# EAGLE design BBB_Cape_schematics (EAGLE 6.2)

## Sheet 1 of 3: BB_Cape pinouts
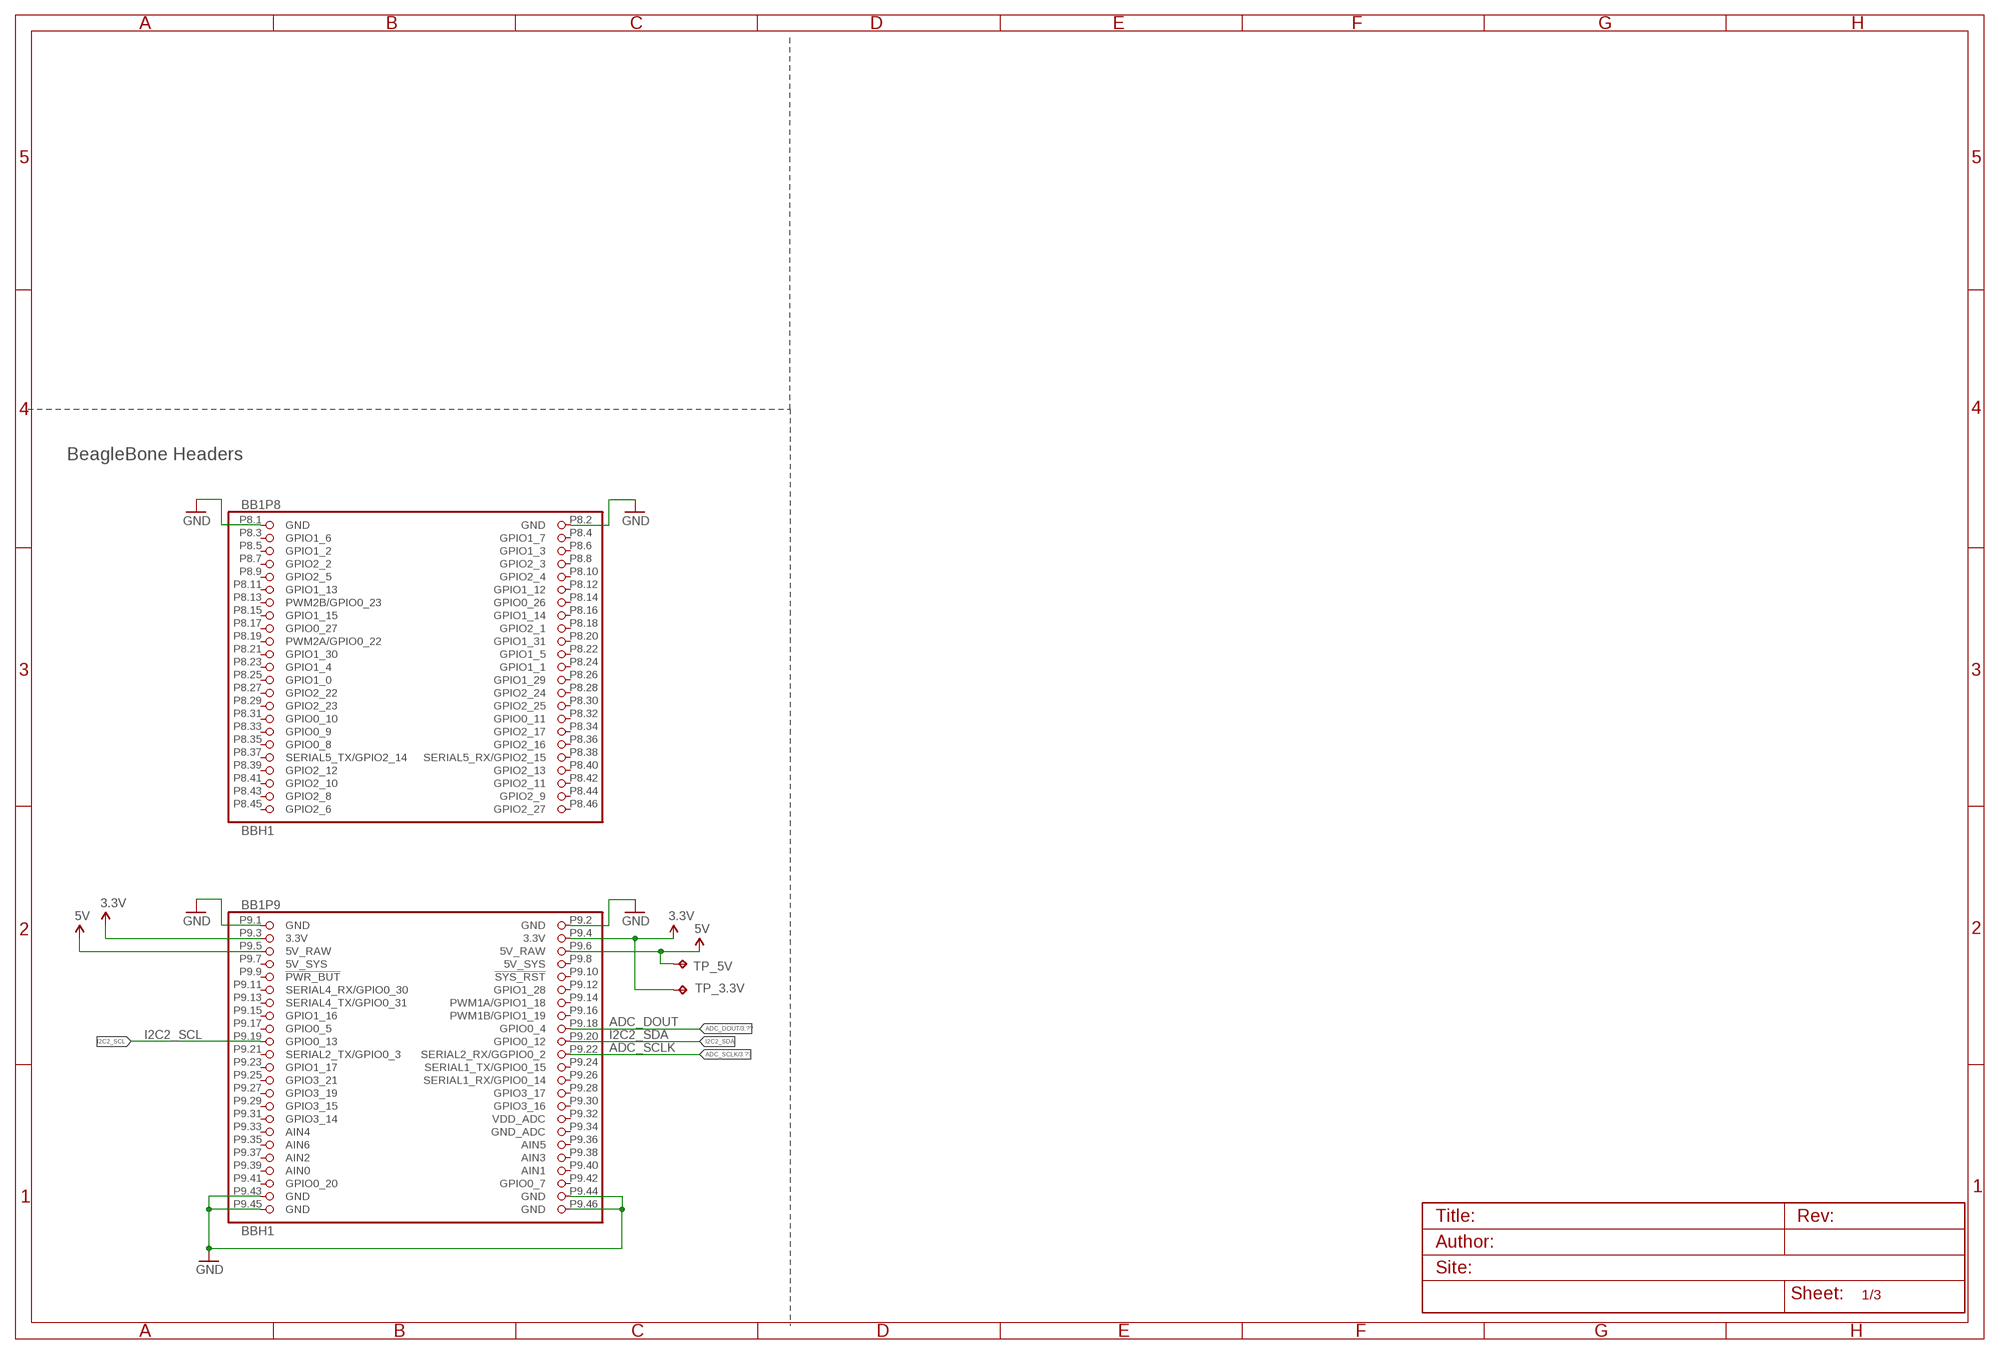
[diagram p0: schematic, sheet 1]

### Parts
BB1  BBH1  [BB_CAPE]
TP_3.3V  TPB2,54  [B2,54]
TP_5V  TPB2,54  [B2,54]

### Nets
3.3V: BB1.P9.3(P9:3.3V) BB1.P9.4(P9:3.3V) TP_3.3V.TP ; also sheet 3
5V: BB1.P9.5(P9:5V_RAW) BB1.P9.6(P9:5V_RAW) TP_5V.TP ; also sheet 2,3
ADC_DOUT: BB1.P9.18(P9:GPIO0_4) ; also sheet 3
ADC_SCLK: BB1.P9.22(P9:SERIAL2_RX/GGPIO0_2) ; also sheet 3
GND: BB1.P8.1(P8:GND) BB1.P8.2(P8:GND) BB1.P9.1(P9:GND) BB1.P9.2(P9:GND) BB1.P9.43(P9:GND) BB1.P9.44(P9:GND) BB1.P9.45(P9:GND) BB1.P9.46(P9:GND) ; also sheet 2,3
I2C2_SCL: BB1.P9.19(P9:GPIO0_13)
I2C2_SDA: BB1.P9.20(P9:GPIO0_12)
Unconnected: BB1.P8.3(P8:GPIO1_6) BB1.P8.4(P8:GPIO1_7) BB1.P8.5(P8:GPIO1_2) BB1.P8.6(P8:GPIO1_3) BB1.P8.7(P8:GPIO2_2) BB1.P8.8(P8:GPIO2_3) BB1.P8.9(P8:GPIO2_5) BB1.P8.10(P8:GPIO2_4) BB1.P8.11(P8:GPIO1_13) BB1.P8.12(P8:GPIO1_12) BB1.P8.13(P8:PWM2B/GPIO0_23) BB1.P8.14(P8:GPIO0_26) BB1.P8.15(P8:GPIO1_15) BB1.P8.16(P8:GPIO1_14) BB1.P8.17(P8:GPIO0_27) BB1.P8.18(P8:GPIO2_1) BB1.P8.19(P8:PWM2A/GPIO0_22) BB1.P8.20(P8:GPIO1_31) BB1.P8.21(P8:GPIO1_30) BB1.P8.22(P8:GPIO1_5) BB1.P8.23(P8:GPIO1_4) BB1.P8.24(P8:GPIO1_1) BB1.P8.25(P8:GPIO1_0) BB1.P8.26(P8:GPIO1_29) BB1.P8.27(P8:GPIO2_22) BB1.P8.28(P8:GPIO2_24) BB1.P8.29(P8:GPIO2_23) BB1.P8.30(P8:GPIO2_25) BB1.P8.31(P8:GPIO0_10) BB1.P8.32(P8:GPIO0_11) BB1.P8.33(P8:GPIO0_9) BB1.P8.34(P8:GPIO2_17) BB1.P8.35(P8:GPIO0_8) BB1.P8.36(P8:GPIO2_16) BB1.P8.37(P8:SERIAL5_TX/GPIO2_14) BB1.P8.38(P8:SERIAL5_RX/GPIO2_15) BB1.P8.39(P8:GPIO2_12) BB1.P8.40(P8:GPIO2_13) BB1.P8.41(P8:GPIO2_10) BB1.P8.42(P8:GPIO2_11) BB1.P8.43(P8:GPIO2_8) BB1.P8.44(P8:GPIO2_9) BB1.P8.45(P8:GPIO2_6) BB1.P8.46(P8:GPIO2_27) BB1.P9.9(P9:!PWR_BUT) BB1.P9.10(P9:!SYS_RST) BB1.P9.11(P9:SERIAL4_RX/GPIO0_30) BB1.P9.12(P9:GPIO1_28) BB1.P9.13(P9:SERIAL4_TX/GPIO0_31) BB1.P9.14(P9:PWM1A/GPIO1_18) BB1.P9.15(P9:GPIO1_16) BB1.P9.16(P9:PWM1B/GPIO1_19) BB1.P9.17(P9:GPIO0_5) BB1.P9.21(P9:SERIAL2_TX/GPIO0_3) BB1.P9.23(P9:GPIO1_17) BB1.P9.24(P9:SERIAL1_TX/GPIO0_15) BB1.P9.25(P9:GPIO3_21) BB1.P9.26(P9:SERIAL1_RX/GPIO0_14) BB1.P9.27(P9:GPIO3_19) BB1.P9.28(P9:GPIO3_17) BB1.P9.29(P9:GPIO3_15) BB1.P9.30(P9:GPIO3_16) BB1.P9.31(P9:GPIO3_14) BB1.P9.32(P9:VDD_ADC) BB1.P9.33(P9:AIN4) BB1.P9.34(P9:GND_ADC) BB1.P9.35(P9:AIN6) BB1.P9.36(P9:AIN5) BB1.P9.37(P9:AIN2) BB1.P9.38(P9:AIN3) BB1.P9.39(P9:AIN0) BB1.P9.40(P9:AIN1) BB1.P9.41(P9:GPIO0_20) BB1.P9.42(P9:GPIO0_7)

### Notes on the sheet
- BeagleBone Headers
- ADC_DOUT
- ADC_SCLK

## Sheet 2 of 3: ECG_circuit
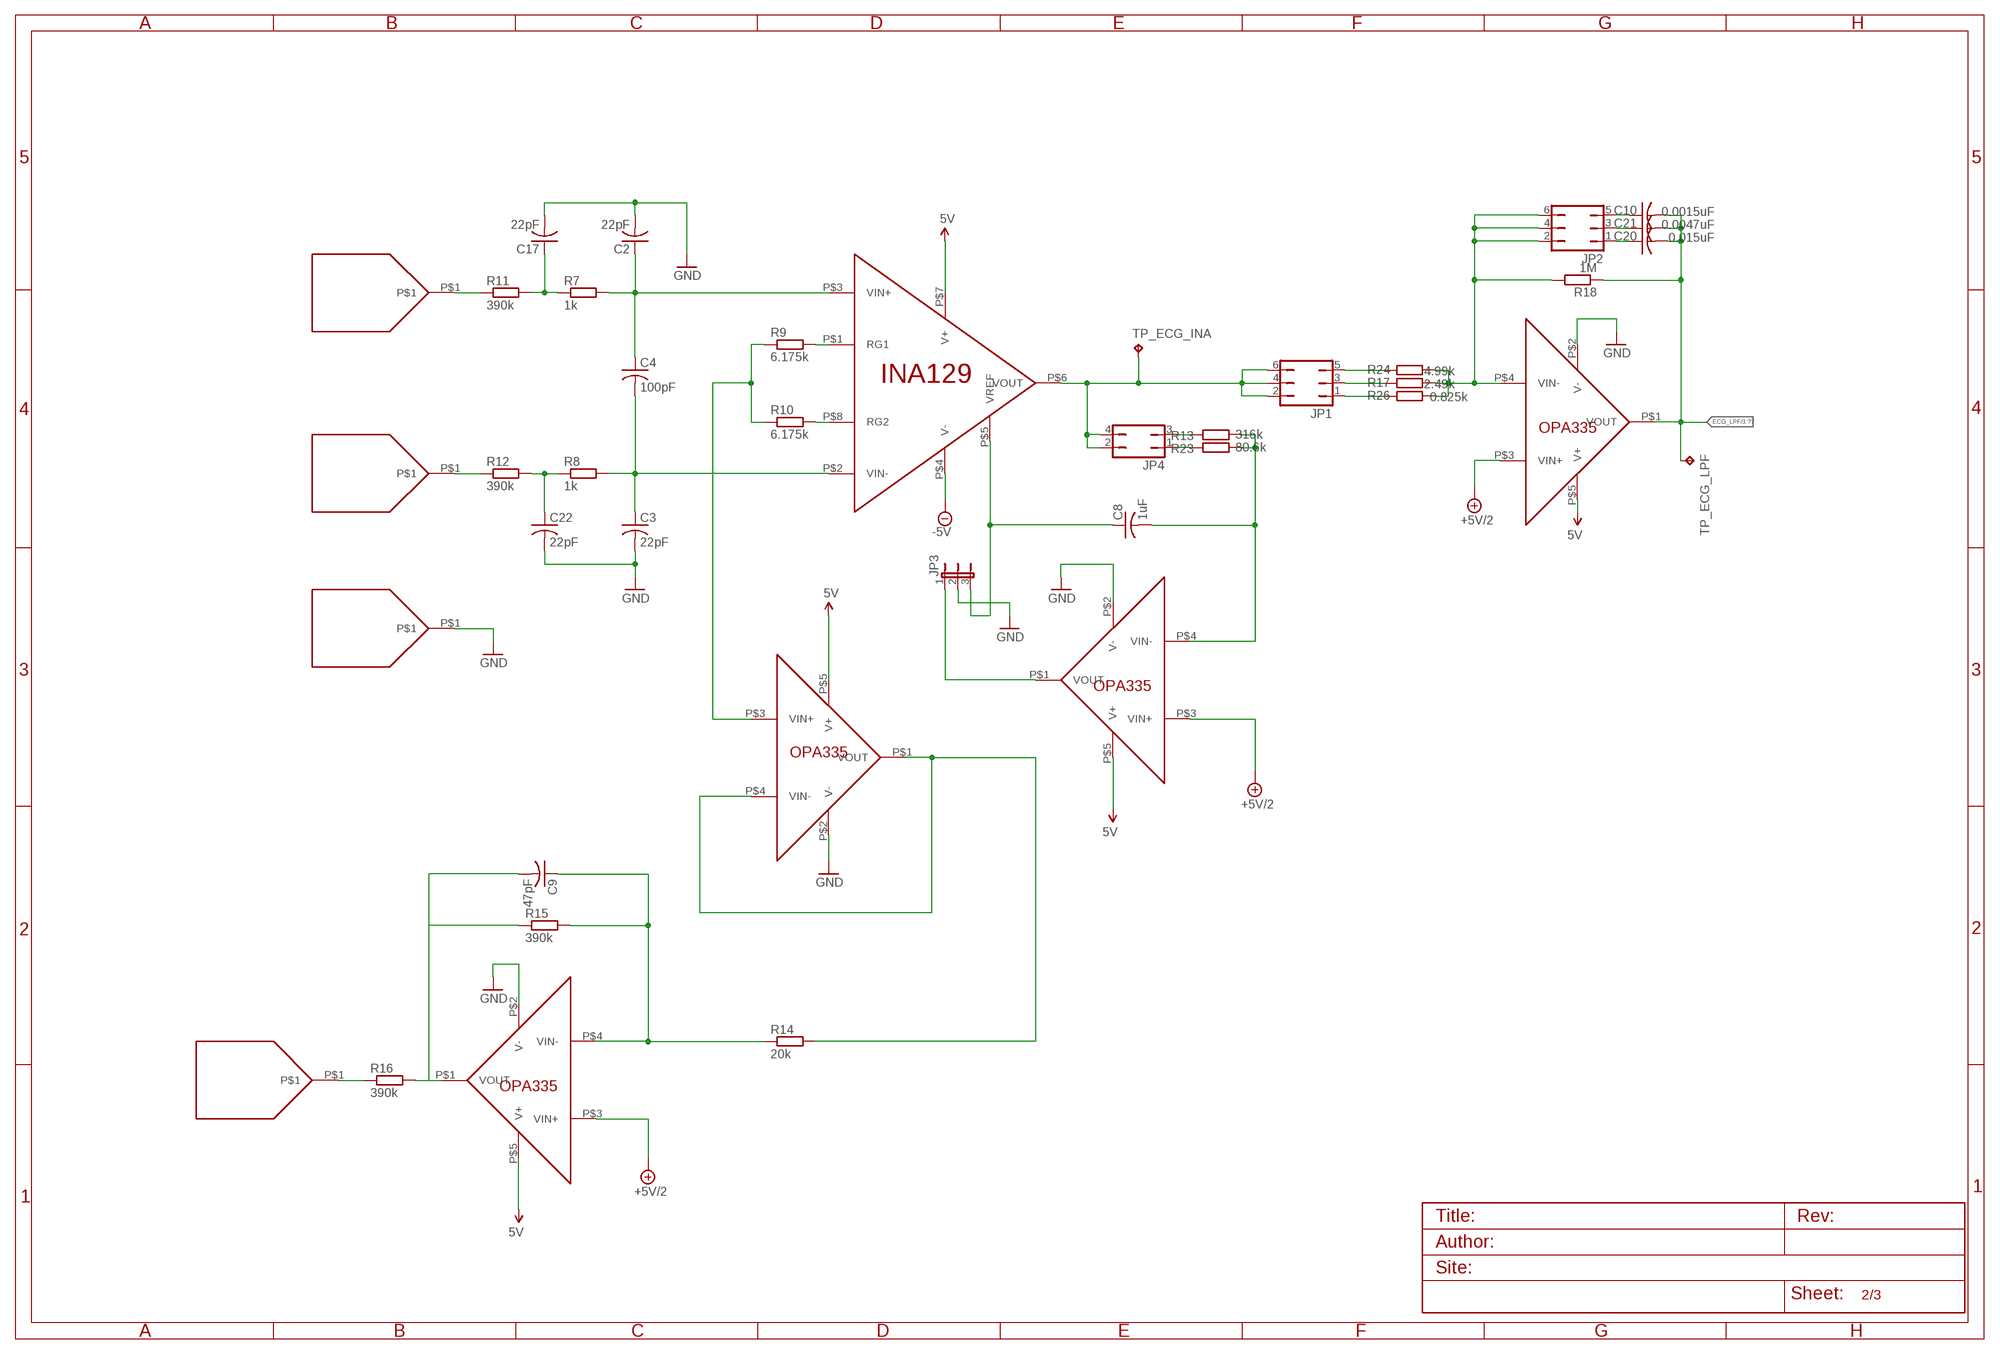
[diagram p1: schematic, sheet 2]

### Parts
C2  22pF  C-USC1206  [C1206]
C3  22pF  C-USC1206  [C1206]
C4  100pF  C-USC1206  [C1206]
C8  1uF  C-USC1206  [C1206]
C9  47pF  C-USC1206  [C1206]
C10  0.0015uF  C-USC1206  [C1206]
C17  22pF  C-USC1206  [C1206]
C20  0.015uF  C-USC1206  [C1206]
C21  0.0047uF  C-USC1206  [C1206]
C22  22pF  C-USC1206  [C1206]
JP1  JP3Q  [JP3Q]
JP2  JP3Q  [JP3Q]
JP3  JP2E  [JP2]
JP4  JP2Q  [JP2Q]
LH  PAD  [RECT_PAD]
LH_INDEX  PAD  [RECT_PAD]
R7  1k  R-EU_M1206  [M1206]
R8  1k  R-EU_M1206  [M1206]
R9  6.175k  R-EU_M1206  [M1206]
R10  6.175k  R-EU_M1206  [M1206]
R11  390k  R-EU_M1206  [M1206]
R12  390k  R-EU_M1206  [M1206]
R13  316k  R-EU_M1206  [M1206]
R14  20k  R-EU_M1206  [M1206]
R15  390k  R-EU_M1206  [M1206]
R16  390k  R-EU_M1206  [M1206]
R17  2.49k  R-EU_M1206  [M1206]
R18  1M  R-EU_M1206  [M1206]
R23  80.6k  R-EU_M1206  [M1206]
R24  4.99k  R-EU_M1206  [M1206]
R26  0.825k  R-EU_M1206  [M1206]
RH  PAD  [RECT_PAD]
RH_INDEX  PAD  [RECT_PAD]
TP_ECG_INA  TPB2,54  [B2,54]
TP_ECG_LPF  TPB2,54  [B2,54]
U4  INA129  [INA129]
U9  OPA335  [SOT23-5]
U11  OPA335  [SOT23-5]
U12  OPA335  [SOT23-5]
U13  OPA335  [SOT23-5]

### Nets
5V: U4.P$7(V+) U9.P$5(V+) U11.P$5(V+) U12.P$5(V+) U13.P$5(V+) ; also sheet 1,3
+5V/2: U9.P$3(VIN+) U12.P$3(VIN+) U13.P$3(VIN+) ; also sheet 3
-5V: U4.P$4(V-) ; also sheet 3
ECG_LPF: C10.2 C20.2 C21.2 R18.1 TP_ECG_LPF.TP U13.P$1(VOUT) ; also sheet 3
GND: C2.2 C3.2 C17.2 C22.2 JP3.2 RH_INDEX.P$1 U9.P$2(V-) U11.P$2(V-) U12.P$2(V-) U13.P$2(V-) ; also sheet 1,3
N$1: C2.1 C4.1 R7.2 U4.P$3(VIN+)
N$2: C3.1 C4.2 R8.2 U4.P$2(VIN-)
N$3: R9.2 U4.P$1(RG1)
N$4: R10.2 U4.P$8(RG2)
N$5: R9.1 R10.1 U11.P$3(VIN+)
N$7: C17.1 R7.1 R11.2
N$8: C22.1 R8.1 R12.2
N$10: C8.1 JP3.3 U4.P$5(VREF)
N$11: JP1.2 JP1.4 JP1.6 JP4.2 JP4.4 TP_ECG_INA.TP U4.P$6(VOUT)
N$12: C8.2 R13.2 R23.2 U9.P$4(VIN-)
N$16: R14.2 U11.P$1(VOUT) U11.P$4(VIN-)
N$17: C9.1 R14.1 R15.2 U12.P$4(VIN-)
N$18: JP2.2 JP2.4 JP2.6 R17.1 R18.2 R24.1 R26.1 U13.P$4(VIN-)
N$19: C9.2 R15.1 R16.2 U12.P$1(VOUT)
N$22: LH_INDEX.P$1 R16.1
N$23: R11.1 RH.P$1
N$24: LH.P$1 R12.1
N$33: JP4.3 R13.1
N$34: JP4.1 R23.1
N$35: JP3.1 U9.P$1(VOUT)
N$36: JP1.5 R24.2
N$37: JP1.3 R17.2
N$38: JP1.1 R26.2
N$40: C10.1 JP2.5
N$41: C21.1 JP2.3
N$42: C20.1 JP2.1

## Sheet 3 of 3: Power Supply
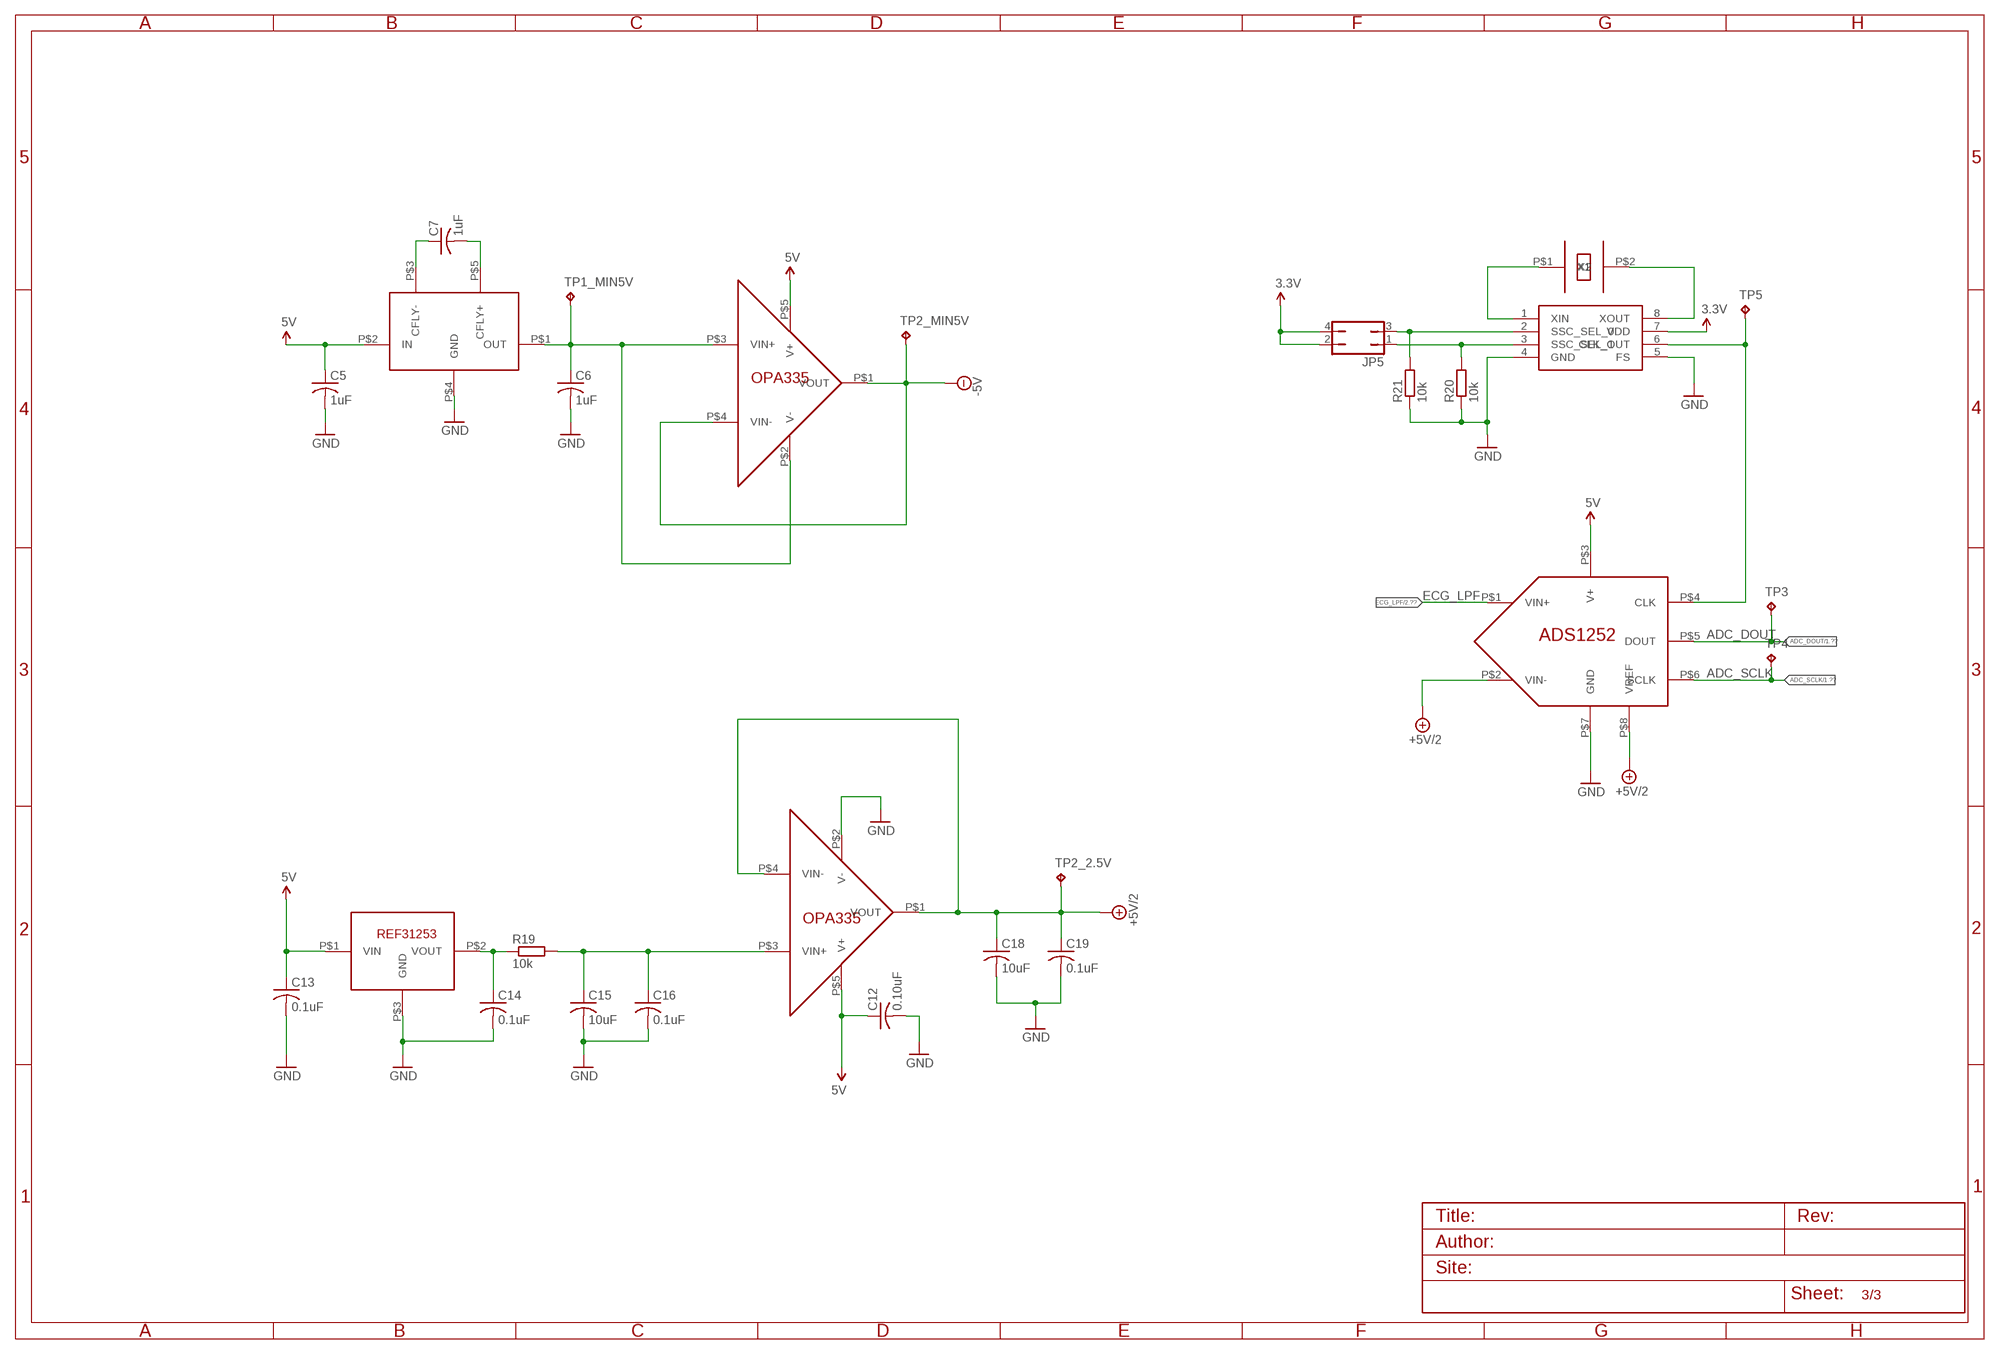
[diagram p2: schematic, sheet 3]

### Parts
C5  1uF  C-USC1206  [C1206]
C6  1uF  C-USC1206  [C1206]
C7  1uF  C-USC1206  [C1206]
C12  0.10uF  C-USC1206  [C1206]
C13  0.1uF  C-USC1206  [C1206]
C14  0.1uF  C-USC1206  [C1206]
C15  10uF  C-USC1206  [C1206]
C16  0.1uF  C-USC1206  [C1206]
C18  10uF  C-USC1206  [C1206]
C19  0.1uF  C-USC1206  [C1206]
JP5  JP2Q  [JP2Q]
R19  10k  R-EU_M1206  [M1206]
R20  10k  R-EU_M1206  [M1206]
R21  10k  R-EU_M1206  [M1206]
TP1_MIN5V  TPB2,54  [B2,54]
TP2_2.5V  TPB2,54  [B2,54]
TP2_MIN5V  TPB2,54  [B2,54]
TP3  TPB2,54  [B2,54]
TP4  TPB2,54  [B2,54]
TP5  TPB2,54  [B2,54]
U5  TPS60403  [SOT23-5]
U10  CDCS502  [SSOP-8]
U14  OPA335  [SOT23-5]
U19  ADS1252  [SOIC-8]
U21  REF3125  [SOT23-3]
U22  OPA335  [SOT23-5]
U23  ATS16ASM-1  [CRYSTAL_SMD]

### Nets
3.3V: JP5.2 JP5.4 U10.7(VDD) ; also sheet 1
5V: C5.1 C12.1 C13.1 U5.P$2(IN) U14.P$5(V+) U19.P$3(V+) U21.P$1(VIN) U22.P$5(V+) ; also sheet 1,2
+5V/2: C18.1 C19.1 TP2_2.5V.TP U19.P$2(VIN-) U19.P$8(VREF) U22.P$1(VOUT) U22.P$4(VIN-) ; also sheet 2
-5V: TP2_MIN5V.TP U14.P$1(VOUT) U14.P$4(VIN-) ; also sheet 2
ADC_DOUT: TP3.TP U19.P$5(DOUT) ; also sheet 1
ADC_SCLK: TP4.TP U19.P$6(SCLK) ; also sheet 1
ECG_LPF: U19.P$1(VIN+) ; also sheet 2
GND: C5.2 C6.2 C12.2 C13.2 C14.2 C15.2 C16.2 C18.2 C19.2 R20.1 R21.1 U5.P$4(GND) U10.4(GND) U10.5(FS) U19.P$7(GND) U21.P$3(GND) U22.P$2(V-) ; also sheet 1,2
N$6: C7.2 U5.P$5(CFLY+)
N$9: C7.1 U5.P$3(CFLY-)
N$21: C6.1 TP1_MIN5V.TP U5.P$1(OUT) U14.P$2(V-) U14.P$3(VIN+)
N$25: C14.1 R19.1 U21.P$2(VOUT)
N$26: C15.1 C16.1 R19.2 U22.P$3(VIN+)
N$27: U10.1(XIN) U23.P$1(X1)
N$28: U10.8(XOUT) U23.P$2(X2)
N$29: TP5.TP U10.6(CLK_OUT) U19.P$4(CLK)
N$30: JP5.3 R21.2 U10.2(SSC_SEL_0)
N$31: JP5.1 R20.2 U10.3(SSC_SEL_1)

### Notes on the sheet
- ECG_LPF
- ADC_DOUT
- ADC_SCLK
- REF31253

## Power pins joined to a net without a drawn wire
5V_SYS: BB1.P9.7(P9:5V_SYS) BB1.P9.8(P9:5V_SYS)

## Library data of the parts
BB1 = logic-supply:BBH: BeagleBone header sub-assembly BBH1 outdated, use BBH2 or BBH3 only; PARTNO: BBH1
C2-C10 C12-C22 = rcl:C-US: CAPACITOR, American symbol
JP1 JP2 = jumper:JP3Q: JUMPER
JP3 = jumper:JP2E: JUMPER
JP4 JP5 = jumper:JP2Q: JUMPER
LH LH_INDEX RH RH_INDEX = Components:PAD
R7-R21 R23 R24 R26 = resistor:R-EU_: RESISTOR, European symbol
TP1_MIN5V TP2_2.5V TP2_MIN5V TP3-TP5 TP_3.3V TP_5V TP_ECG_INA TP_ECG_LPF = testpad:TP: Test pad
U4 = Components:INA129
U5 = Components:TPS60403
U9 U11-U14 U22 = Components:OPA335
U10 = Components:CDCS502
U19 = Components:ADS1252
U21 = Components:REF3125
U23 = Components:ATS16ASM-1

## Board
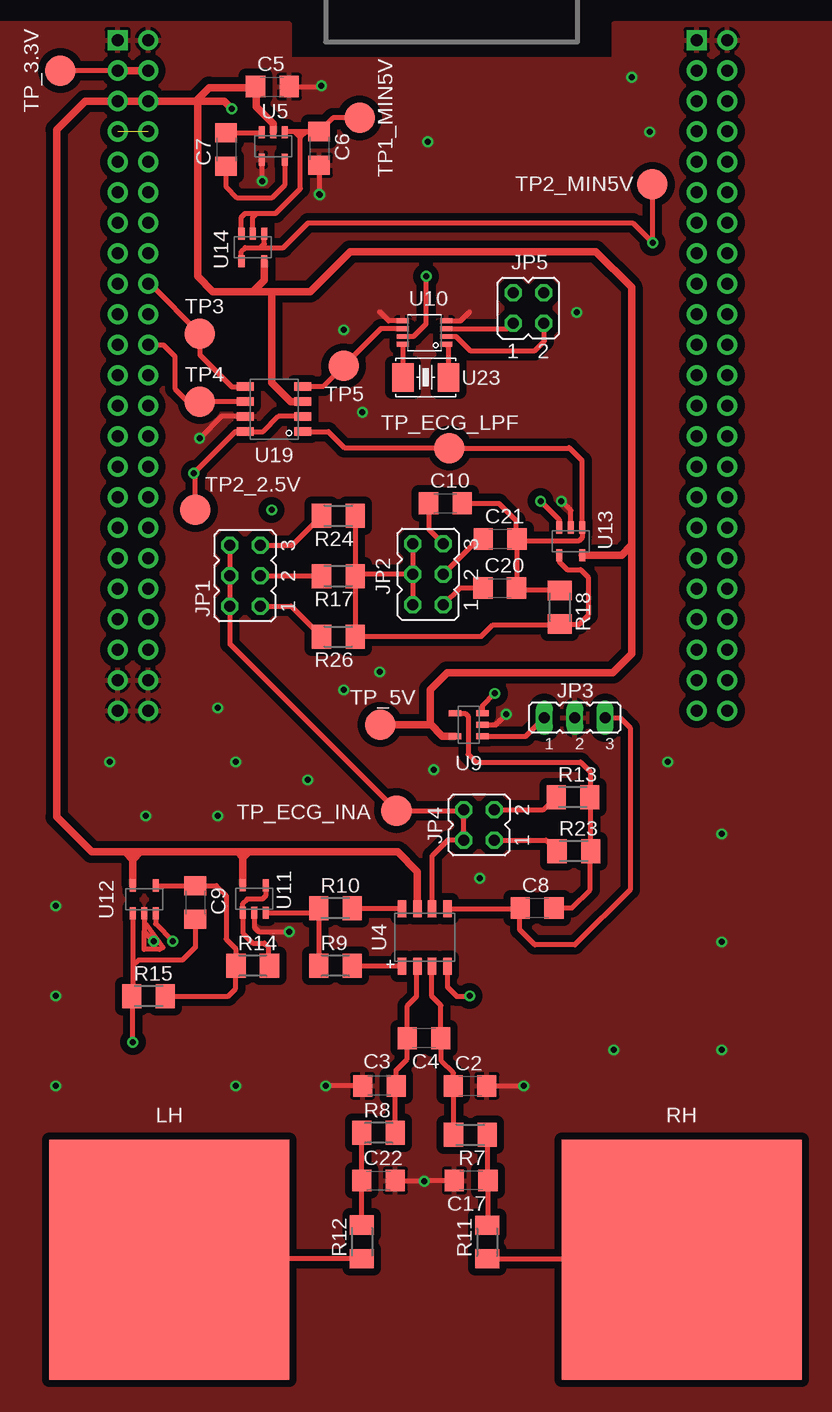
[diagram p3: board, top side]
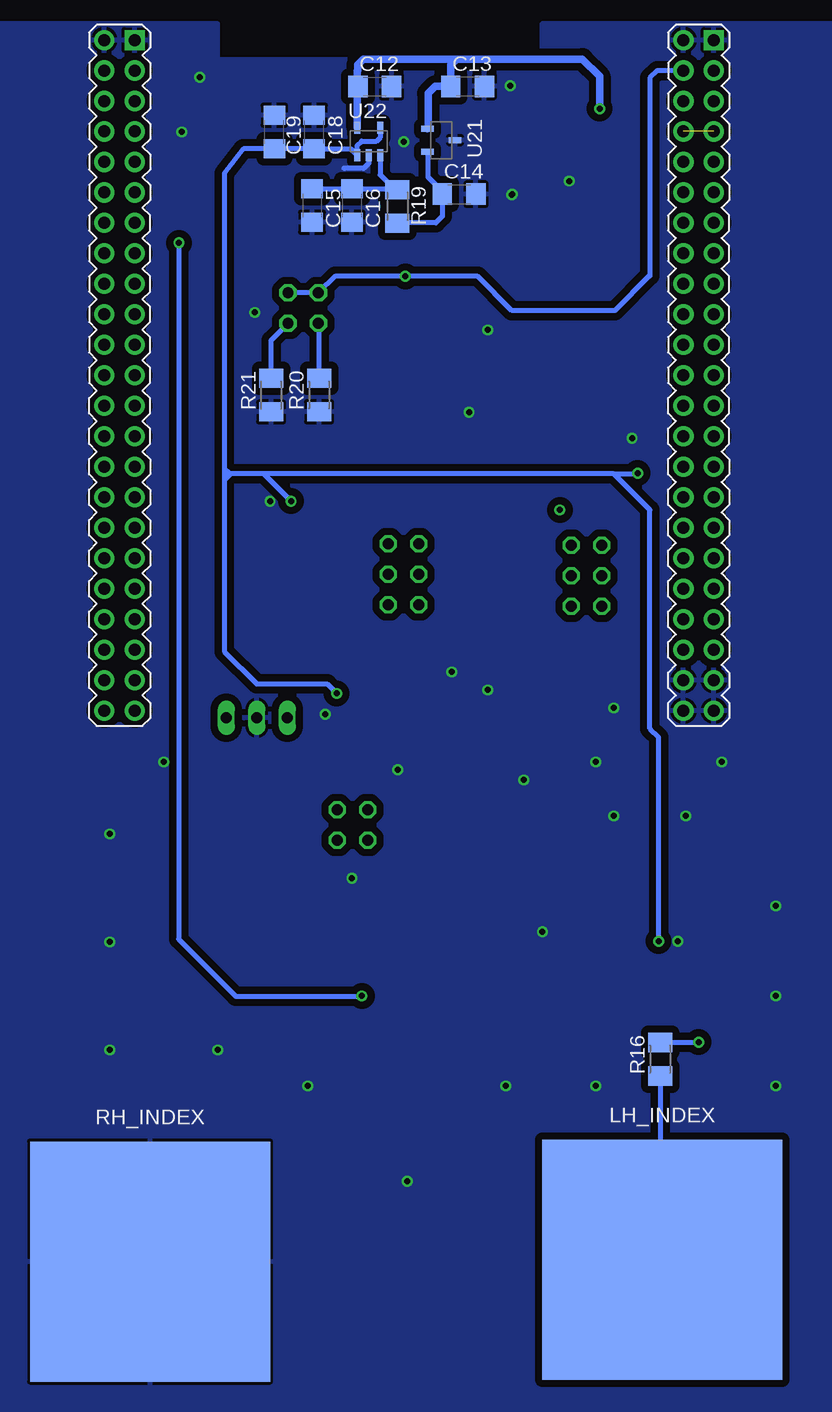
[diagram p4: board, bottom side, seen from below]

No outline drawn. Coordinates in mm, seen from the top.
Copper layers (1*16): Top 0.035mm / dielectric 1.5mm / Bottom 0.035mm
Design rules: minimum track width 10mil, minimum drill 24mil, track to track 8mil, track to pad 8mil, pad to pad 8mil, via to via 8mil, smd to smd 8mil, copper to edge 40mil, drill to drill 8mil, minimum pad ring 10mil, minimum via ring 8mil, stop-mask expansion 4mil, vias tented up to drill 0mil, thermal gap 10mil

### Footprints (pad centres in the part's own frame; a part is rotated, then mirrored left to right if it is on the bottom)
BB_CAPE = drill 1 pad 1.676 square: P8.1 4.445,19.05; P9.1 52.705,19.05 | drill 1 pad 1.676: P8.2 1.905,19.05; P8.3 4.445,21.59; P8.4 1.905,21.59; P8.5 4.445,24.13; P8.6 1.905,24.13; P8.7 4.445,26.67; P8.8 1.905,26.67; P8.9 4.445,29.21; P8.10 1.905,29.21; P8.11 4.445,31.75; P8.12 1.905,31.75; P8.13 4.445,34.29; P8.14 1.905,34.29; P8.15 4.445,36.83; P8.16 1.905,36.83; P8.17 4.445,39.37; P8.18 1.905,39.37; P8.19 4.445,41.91; P8.20 1.905,41.91; P8.21 4.445,44.45; P8.22 1.905,44.45; P8.23 4.445,46.99; P8.24 1.905,46.99; P8.25 4.445,49.53; P8.26 1.905,49.53; P8.27 4.445,52.07; P8.28 1.905,52.07; P8.29 4.445,54.61; P8.30 1.905,54.61; P8.31 4.445,57.15; P8.32 1.905,57.15; P8.33 4.445,59.69; P8.34 1.905,59.69; P8.35 4.445,62.23; P8.36 1.905,62.23; P8.37 4.445,64.77; P8.38 1.905,64.77; P8.39 4.445,67.31; P8.40 1.905,67.31; P8.41 4.445,69.85; P8.42 1.905,69.85; P8.43 4.445,72.39; P8.44 1.905,72.39; P8.45 4.445,74.93; P8.46 1.905,74.93; P9.2 50.165,19.05; P9.3 52.705,21.59; P9.4 50.165,21.59; P9.5 52.705,24.13; P9.6 50.165,24.13; P9.7 52.705,26.67; P9.8 50.165,26.67; P9.9 52.705,29.21; P9.10 50.165,29.21; P9.11 52.705,31.75; P9.12 50.165,31.75; P9.13 52.705,34.29; P9.14 50.165,34.29; P9.15 52.705,36.83; P9.16 50.165,36.83; P9.17 52.705,39.37; P9.18 50.165,39.37; P9.19 52.705,41.91; P9.20 50.165,41.91; P9.21 52.705,44.45; P9.22 50.165,44.45; P9.23 52.705,46.99; P9.24 50.165,46.99; P9.25 52.705,49.53; P9.26 50.165,49.53; P9.27 52.705,52.07; P9.28 50.165,52.07; P9.29 52.705,54.61; P9.30 50.165,54.61; P9.31 52.705,57.15; P9.32 50.165,57.15; P9.33 52.705,59.69; P9.34 50.165,59.69; P9.35 52.705,62.23; P9.36 50.165,62.23; P9.37 52.705,64.77; P9.38 50.165,64.77; P9.39 52.705,67.31; P9.40 50.165,67.31; P9.41 52.705,69.85; P9.42 50.165,69.85; P9.43 52.705,72.39; P9.44 50.165,72.39; P9.45 52.705,74.93; P9.46 50.165,74.93
C1206 = smd 1.6 x 1.8: 1 -1.4,0; 2 1.4,0
JP3Q = drill 0.914 octagon: 1 -2.54,-1.27; 2 -2.54,1.27; 3 0,-1.27; 4 0,1.27; 5 2.54,-1.27; 6 2.54,1.27
JP2 = drill 0.914 long: 1 -2.54,0; 2 0,0; 3 2.54,0
JP2Q = drill 0.914 octagon: 1 -1.27,-1.27; 2 -1.27,1.27; 3 1.27,-1.27; 4 1.27,1.27
RECT_PAD = smd 20 x 20: P$1 0,0
M1206 = smd 1.6 x 2: 1 -1.4,0; 2 1.4,0
B2,54 = smd 2.54 x 2.54: TP 0,0
INA129 = smd 1.422 x 0.711: P$1 -2.4,1.885; P$2 -2.4,0.615; P$3 -2.4,-0.615; P$4 -2.4,-1.885; P$5 2.4,-1.885; P$6 2.4,-0.615; P$7 2.4,0.615; P$8 2.4,1.885
SOT23-5 = smd 0.508 x 1.016: P$1 -0.95,-1.15; P$2 0,-1.15; P$3 0.95,-1.15; P$4 0.95,1.15; P$5 -0.95,1.15
SSOP-8 = smd 1 x 0.4: 1 -1.8,0.975; 2 -1.8,0.325; 3 -1.8,-0.325; 4 -1.8,-0.975; 5 1.8,-0.975; 6 1.8,-0.325; 7 1.8,0.325; 8 1.8,0.975
SOIC-8 = smd 1.422 x 0.711: P$1 -2.4,1.885; P$2 -2.4,0.615; P$3 -2.4,-0.615; P$4 -2.4,-1.885; P$5 2.4,-1.885; P$6 2.4,-0.615; P$7 2.4,0.615; P$8 2.4,1.885
SOT23-3 = smd 0.508 x 1.016: P$1 -0.95,-1.15; P$2 0.95,-1.15; P$3 0,1.15
CRYSTAL_SMD = smd 1.8 x 2.4: P$1 -1.9,0; P$2 1.9,0

### Placement (x,y rotation side)
BB1  69.87,140.71 180 top
C2  46.54,34.51 0 top
C3  38.98,34.51 180 top
C4  42.7,38.48 180 top
C5  30.06,117.78 0 top
C6  33.95,112.64 270 top
C7  26.21,112.53 270 top
C8  52.13,49.34 0 top
C9  23.64,49.79 270 top
C10  44.47,83.06 0 top
C12  45.43,117.79 0 bottom
C13  37.69,117.8 0 bottom
C14  38.4,108.83 0 bottom
C15  50.66,107.87 270 bottom
C16  47.34,107.87 270 bottom
C17  46.63,26.62 180 top
C18  50.48,114 90 bottom
C19  53.79,114 90 bottom
C20  49.01,76 0 top
C21  49.04,80.09 0 top
C22  38.91,26.62 0 top
JP1  27.79,77.03 90 top
JP2  43.04,77.14 90 top
JP3  55.26,65.19 0 top
JP4  47.29,56.25 90 top
JP5  51.39,99.32 0 top
LH  21.48,20.02 0 top
LH_INDEX  21.48,20.02 0 bottom
R7  46.56,30.43 180 top
R8  38.91,30.59 0 top
R9  35.32,44.52 0 top
R10  35.32,49.32 0 top
R11  47.96,21.49 90 top
R12  37.53,21.51 90 top
R13  55.11,58.57 0 top
R14  28.43,44.52 0 top
R15  19.75,41.98 0 top
R16  21.65,36.73 90 bottom
R17  35.56,77 180 top
R18  54.03,74.4 270 top
R19  43.54,107.79 90 bottom
R20  50.06,92.08 90 bottom
R21  54.07,92.08 90 bottom
R23  55.18,54.07 0 top
R24  35.56,82.02 180 top
R26  35.56,71.94 180 top
RH  64.16,20.02 0 top
RH_INDEX  64.16,19.86 0 bottom
TP1_MIN5V  37.34,115.18 0 top
TP2_2.5V  23.65,82.52 0 top
TP2_MIN5V  61.72,109.63 0 top
TP3  24.03,97.2 0 top
TP4  24.03,91.52 0 top
TP5  36,94.5 0 top
TP_3.3V  12.4,119.12 0 top
TP_5V  39.05,64.61 0 top
TP_ECG_INA  40.41,57.44 0 top
TP_ECG_LPF  44.82,87.66 0 top
U4  42.75,46.88 90 top
U5  30.14,112.83 180 top
U9  46.43,64.59 90 top
U10  42.74,97.28 180 top
U11  28.56,50.09 0 top
U12  19.38,50.05 0 top
U13  54.93,79.89 180 top
U14  28.44,104.38 180 top
U19  30.2,90.91 180 top
U21  39.89,113.32 270 bottom
U22  45.92,113.21 0 bottom
U23  42.85,93.54 180 top

### Tracks (layer width: path | path; a pad name or v marks a point on that pad's centre or on a via)
3.3V  (via drill 0.5 pad 0.65)
  Top 0.406: U10.7 41.83,96.96 42.88,98.01 v42.88,101.97 | BB1.P9.3 TP_3.3V.TP
  Top 0.61: BB1.P9.3 BB1.P9.4
  Bottom 0.406: BB1.P9.4 21.88,119.12 22.5,118.5 22.5,102 22.54,102 25.42,99.12 33.99,99.12 36.85,101.97 v42.88,101.97 48.73,101.97 JP5.2 JP5.4
5V  (via drill 0.5 pad 0.75)
  Top 0.61: BB1.P9.5 BB1.P9.6 | 28.6,117.85 C5.1 | U5.P$2 30.14,114.7 28.74,116.1 28.74,117.71 C5.1 | BB1.P9.5 23.67,116.58 | 23.67,116.58 23.83,116.74 | C5.1 28.57,117.69 24.79,117.69 23.83,116.74 | U14.P$5 29.39,101.66 28.52,100.78 | 28.52,100.78 28.44,100.7 25.1,100.7 23.83,101.97 23.83,116.74 | 23.67,116.58 26.05,116.58 v26.69,115.94 | 17.8,54 15,54 12.09,56.91 12.09,114.2 14.47,116.58 BB1.P9.5 | 17.8,54 19.07,54 | 19.07,54 27.17,54 | 27.17,54 28.09,54 | 28.09,54 40.5,54 42.14,52.36 U4.P$7 | U11.P$5 27.61,53.56 27.17,54 | U12.P$5 18.43,53.37 17.8,54 | 28.09,54 27.64,53.56 | 18.43,53.24 18.43,53.4 18.47,53.4 19.07,54 | 60,79.5 60,101.05 57.01,104.04 36.53,104.04 33.2,100.7 30.18,100.7 | 60,79.5 60,70.52 58.44,68.95 44.63,68.95 43.2,67.53 43.2,64.67 | U9.P$5 44.22,63.65 43.2,64.67 | 60,79.5 59.94,79.5 59.17,78.73 U13.P$5 | 28.52,100.78 28.59,100.7 30.18,100.7 | U19.P$3 31.58,91.53 30.02,93.08 30.02,100.55 30.18,100.7 | TP_5V.TP 43.14,64.61 43.2,64.67
  Bottom 0.61: C12.1 46.87,117.75 U22.P$5 46.87,119.1 46.85,119.12 46.85,119.6 46.38,120.07 38.6,120.07 | U21.P$1 40.98,114.33 40.98,117.22 40.4,117.8 C13.1 39.09,119.58 38.6,120.07 | 38.6,120.07 28.12,120.07 26.69,118.64 v26.69,115.94
5V_SYS  (1 unrouted)
+5V/2  (via drill 0.5 pad 0.65)
  Top 0.406: U12.P$3 20.33,48.01 v21.77,46.57 | U9.P$3 47.58,66.19 v48.6,67.21 | U13.P$3 53.98,81.67 v52.41,83.24 | U19.P$2 30.57,90.3 29.3,89.03 U19.P$8 26.98,89.03 v23.52,85.57 23.65,85.45 TP2_2.5V.TP
  Bottom 0.406: U22.P$4 44.95,114.33 44.95,113.56 45.26,113.25 46.53,113.25 46.87,112.91 U22.P$1 47.41,112.6 C18.1 C19.1 56.39,112.6 57.96,110.55 57.96,85.94 | 57.96,85.94 57.96,84.99 | 57.96,84.99 57.96,70.7 55.27,68 49.39,68 v48.6,67.21 48.91,67.53 | v21.77,46.57 21.77,63.56 22.5,64.29 22.5,82.5 25.5,85.5 | 25.5,85.5 54.66,85.5 | 54.66,85.5 v52.41,83.24 | 54.66,85.5 57.52,85.5 57.96,85.94 | 57.96,84.99 57.49,85.47 | 25.5,85.5 23.59,85.5 v23.52,85.57
-5V  (via drill 0.5 pad 0.65)
  Top 0.406: U14.P$4 27.49,104.04 27.8,104.36 29.07,104.36 | 29.07,104.36 29.39,104.67 U14.P$1 | 29.07,104.36 30.98,104.36 33.04,106.42 60.08,106.42 v61.75,104.75 61.72,104.78 TP2_MIN5V.TP | U4.P$4 44.64,42.75 45.42,41.97 46.47,41.97 v46.5,42
  Bottom 0.406: v61.75,104.75 61.77,104.73 61.77,46.73 57.01,41.97 46.53,41.97 v46.5,42
ADC_DOUT
  Top 0.406: U19.P$5 27.77,92.77 26.69,92.77 24.03,95.43 TP3.TP 19.89,101.34 BB1.P9.18
ADC_SCLK
  Top 0.406: U19.P$6 TP4.TP 24,91.5 23.04,91.5 21.93,92.61 21.93,95.31 20.98,96.26 BB1.P9.22
ECG_LPF
  Top 0.406: C10.2 48.94,83.06 50.34,81.66 50.34,80.19 C21.2 | C21.2 50.44,76.5 | 50.44,76.5 50.44,76.03 C20.2 | C21.2 50.63,79.91 55.58,79.91 55.88,80.2 U13.P$1 55.88,86.6 54.79,87.69 54.76,87.66 TP_ECG_LPF.TP 44.79,87.69 36.06,87.69 34.72,89.03 U19.P$1 | R18.1 51.15,75.8 50.44,76.5
GND  (via drill 0.5, 0.5 pad 0.65)
  Top 0.406: U5.P$4 29.19,109.94 v29.21,109.91 | C6.2 33.95,108.83 v33.98,108.8 v34,108.78 | C5.2 34.09,117.78 v34.15,117.85 | C22.2 42.67,26.62 v42.72,26.57 42.78,26.62 C17.2 | C3.2 v34.51,34.51 v34.5,34.5 | C2.2 v50.99,34.51 v51,34.5 | U11.P$2 28.56,47.72 28.91,47.37 v31.45,47.37 | U12.P$2 19.38,47.37 v20.18,46.57 | U9.P$2 48.68,64.59 v49.55,65.46 | U13.P$2 54.93,82.47 v54.15,83.24 | U10.4 45.76,98.26 46.5,99 | U10.5 39.74,98.26 39,99 | U19.P$7 25.8,90.3 v23.99,88.48
  Bottom 0.406: U22.P$2 45.92,111.4 46.35,110.97 47.97,110.97 48,111
  other vias: 55.42,98.96 36,97.5 43.52,60.86 27,61.5 47.33,51.81 12,49.5 12,42 12,34.5 27,34.5 58.5,37.5 67.5,37.5 67.5,46.5 67.5,55.5 33,60 25.5,66 25.5,57 16.5,61.5 19.5,57 36,67.5 39,69 63,61.5 37.57,90.64 60.02,118.57 61.5,114 43.02,113.19
  pour Bottom (isolate 0.61): 6,123 31.5,123 31.5,120 58.5,120 58.5,123 79.5,123 81,123 81,7.5 6,7.5 6,9
  pour Top (isolate 0.61): 6,7.5 81,7.5 81,123 58.5,123 58.5,120 31.5,120 31.5,123 6,123
N$1
  Top 0.406: R7.2 45.16,34.49 C2.1 45.14,35.58 44.15,36.57 44.15,38.43 C4.1 44.1,41.22 43.36,41.97 U4.P$3
N$2
  Top 0.406: R8.2 40.31,34.44 C3.1 40.38,35.81 41.3,36.73 41.3,38.47 C4.2 41.3,41.18 42.09,41.97 42.09,44.44 U4.P$2
N$3
  Top 0.406: R9.2 40.83,44.52 U4.P$1
N$4
  Top 0.406: R10.2 40.83,49.32 U4.P$8
N$5
  Top 0.406: R9.1 R10.1 33.54,48.94 U11.P$3
N$6
  Top 0.406: U5.P$5 31.09,109.57 30.01,108.48 27.15,108.48 26.2,109.44 26.2,111.13 C7.2
N$7
  Top 0.406: R7.1 47.96,26.69 C17.1 48.03,22.96 R11.2
N$8
  Top 0.406: R12.2 37.53,26.61 C22.1 R8.1
N$9
  Top 0.406: C7.1 29.14,113.94 U5.P$3
N$10
  Top 0.406: U4.P$5 50.67,49.28 C8.1 50.66,49.28 50.66,47.52 51.93,46.25 55.27,46.25 59.87,50.86 59.87,64.35 59.03,65.19 JP3.3
N$11
  Top 0.406: U4.P$6 43.37,53.67 44.67,54.98 JP4.2 JP4.4 | JP1.6 JP1.4 JP1.2 26.52,71.35 40.41,57.46 TP_ECG_INA.TP 45.94,57.44 JP4.4 | JP4.4
N$12
  Top 0.406: C8.2 55.02,49.34 56.53,50.86 56.53,54.02 R23.2 56.58,58.5 R13.2 56.53,58.6 56.53,60.7 55.74,61.49 47.01,61.49 46.38,62.13 46.38,65.3 46.13,65.55 U9.P$4
N$13
  Top 0.406: 19.5,48 20.95,46.04 20.64,45.88 19.37,45.88 19.37,47.31
N$16
  Top 0.406: U11.P$4 29.51,50.34 29.23,50.06 27.96,50.06 27.61,49.71 U11.P$1 27.61,47.24 28.44,46.41 29.39,46.41 29.71,46.09 29.71,44.65 R14.2
N$17
  Top 0.406: U12.P$4 23.63,51.2 C9.1 25.4,51.19 26.21,50.38 26.21,46.73 27.01,45.94 27.01,44.55 R14.1 27.01,44.5 27.01,42.6 26.39,41.98 R15.2
N$18
  Top 0.406: R17.1 R26.1 36.98,71.97 47.49,71.97 48.44,72.92 53.95,72.92 R18.2 54.1,72.92 55.58,72.92 56.38,73.72 56.38,76.89 55.74,77.53 54.63,77.53 53.98,78.18 U13.P$4 | R24.1 R17.1 | JP2.6 JP2.4 | JP2.4 JP2.2 | JP2.4 37.1,77.14 R17.1
N$19  (via drill 0.5 pad 0.65)
  Top 0.406: U12.P$1 18.43,44.51 | 18.43,44.51 18.43,43.18 R15.1 18.43,41.9 v18.43,38.16 | C9.2 23.64,46.06 22.56,44.98 18.91,44.98 18.43,44.51
  Bottom 0.406: R16.2 18.46,38.13 v18.43,38.16
N$21
  Top 0.406: 31.93,114.03 C6.1 35.1,115.18 TP1_MIN5V.TP | 31.93,114.03 31.14,114.03 U5.P$1 | U14.P$2 28.44,106.9 28.75,107.21 | 28.75,107.21 30.34,107.21 32.41,109.28 32.41,113.56 | 32.41,113.56 31.93,114.03 | 33,114 32.84,114 32.41,113.56 | U14.P$3 27.49,106.9 27.8,107.21 28.75,107.21
N$22
  Bottom 0.406: R16.1 21.65,20.2 LH_INDEX.P$1
N$23
  Top 0.406: 64.11,20.07 RH.P$1 64.09,20.09 R11.1
N$24
  Top 0.406: R12.1 21.56,20.11 LH.P$1
N$25
  Bottom 0.406: U21.P$2 40.98,112.31 40.98,110.23 39.8,109.05 C14.1 39.8,106.97 40.34,106.42 43.51,106.42 R19.1
N$26
  Bottom 0.406: C15.1 C16.1 44.31,109.27 | 44.31,109.27 43.61,109.27 R19.2 | U22.P$3 44.97,110.42 44.31,109.75 44.31,109.27
N$27
  Top 0.406: U23.P$1 44.75,96.09 U10.1
N$28
  Top 0.406: U23.P$2 40.95,96.29 U10.8
N$29
  Top 0.406: U19.P$4 32.56,92.83 34.33,92.83 TP5.TP 39.11,97.61 U10.6
N$30
  Top 0.406: U10.2 45.36,96.96 46.53,95.78 51.93,95.78 52.73,96.58 52.73,97.98 JP5.3
  Bottom 0.406: R21.2 54.07,96.63 JP5.3
N$31
  Top 0.406: U10.3 49.68,97.61 JP5.1
  Bottom 0.406: R20.2 50.06,97.99 JP5.1
N$33
  Top 0.406: JP4.3 52.66,57.52 R13.1
N$34
  Top 0.406: JP4.1 52.87,54.98 R23.1
N$35
  Top 0.406: U9.P$1 51.18,63.65 JP3.1
N$36
  Top 0.406: JP1.5 31.71,79.57 R24.2
N$37
  Top 0.406: JP1.3 34.13,77.03 R17.2
N$38
  Top 0.406: JP1.1 31.62,74.49 R26.2
N$40
  Top 0.406: C10.1 43.07,80.91 JP2.5
N$41
  Top 0.406: C21.1 47.27,80.09 JP2.3
N$42
  Top 0.406: C20.1 45.71,76 JP2.1
N$46  (via drill 0.5 pad 0.65)
  other vias: 30,82.5